# Altium schematic sheet USB.SchDoc
size A4; SheetNumber: 10; SheetTotal: 17
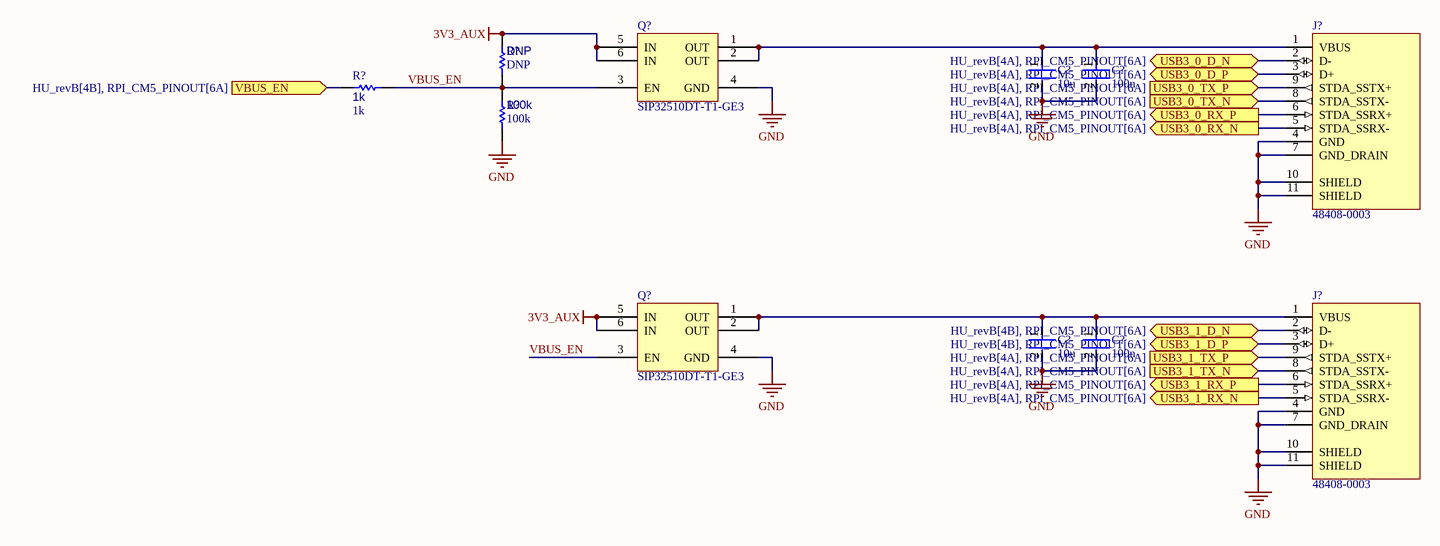
[diagram p0: USB.SchDoc]

## Parts
(Parts that share a designator on the sheet are numbered #1, #2 ... from top to bottom, then left to right.)
C?#1  10u  [FP-0402-L_1_0_0_05-W_0_5-IPC_A]
C?#2  100n  [FP-0402-L_1_0_0_05-W_0_5-IPC_A]
C?#3  10u  [FP-0402-L_1_0_0_05-W_0_5-IPC_A]
C?#4  100n  [FP-0402-L_1_0_0_05-W_0_5-IPC_A]
J?#1  48408-0003  [MOLX-48408-0003_V]
J?#2  48408-0003  [MOLX-48408-0003_V]
Q?#1  SIP32510DT-T1-GE3  [SOT95P284X110-6N]
Q?#2  SIP32510DT-T1-GE3  [SOT95P284X110-6N]
R?#1  DNP  [R0603B]
R?#2  1k  [R0603B]
R?#3  100k  [R0603B]

## Ports
USB3_0_D_N (bidir, see HU_revB[4A], RPI_CM5_PINOUT[6A]), USB3_0_D_P (bidir, see HU_revB[4A], RPI_CM5_PINOUT[6A]), USB3_0_RX_N (out, see HU_revB[4A], RPI_CM5_PINOUT[6A]), USB3_0_RX_P (out, see HU_revB[4A], RPI_CM5_PINOUT[6A]), USB3_0_TX_N (in, see HU_revB[4A], RPI_CM5_PINOUT[6A]), USB3_0_TX_P (in, see HU_revB[4A], RPI_CM5_PINOUT[6A]), USB3_1_D_N (bidir, see HU_revB[4B], RPI_CM5_PINOUT[6A]), USB3_1_D_P (bidir, see HU_revB[4B], RPI_CM5_PINOUT[6A]), USB3_1_RX_N (out, see HU_revB[4A], RPI_CM5_PINOUT[6A]), USB3_1_RX_P (out, see HU_revB[4A], RPI_CM5_PINOUT[6A]), USB3_1_TX_N (in, see HU_revB[4A], RPI_CM5_PINOUT[6A]), USB3_1_TX_P (in, see HU_revB[4A], RPI_CM5_PINOUT[6A]), VBUS_EN (in, see HU_revB[4B], RPI_CM5_PINOUT[6A])

## Nets
3V3_AUX: Q?#1.5(IN) Q?#1.6(IN) Q?#2.5(IN) Q?#2.6(IN) R?#1.2
GND: C?#1.2 C?#2.2 C?#3.2 C?#4.2 J?#1.4(GND) J?#1.7(GND_DRAIN) J?#1.10(SHIELD) J?#1.11(SHIELD) J?#2.4(GND) J?#2.7(GND_DRAIN) J?#2.10(SHIELD) J?#2.11(SHIELD) Q?#1.4(GND) Q?#2.4(GND) R?#3.1
USB3_0_D_N: J?#1.2(D-) ; port USB3_0_D_N
USB3_0_D_P: J?#1.3(D+) ; port USB3_0_D_P
USB3_0_RX_N: J?#1.5(STDA_SSRX-) ; port USB3_0_RX_N
USB3_0_RX_P: J?#1.6(STDA_SSRX+) ; port USB3_0_RX_P
USB3_0_TX_N: J?#1.8(STDA_SSTX-) ; port USB3_0_TX_N
USB3_0_TX_P: J?#1.9(STDA_SSTX+) ; port USB3_0_TX_P
USB3_1_D_N: J?#2.2(D-) ; port USB3_1_D_N
USB3_1_D_P: J?#2.3(D+) ; port USB3_1_D_P
USB3_1_RX_N: J?#2.5(STDA_SSRX-) ; port USB3_1_RX_N
USB3_1_RX_P: J?#2.6(STDA_SSRX+) ; port USB3_1_RX_P
USB3_1_TX_N: J?#2.8(STDA_SSTX-) ; port USB3_1_TX_N
USB3_1_TX_P: J?#2.9(STDA_SSTX+) ; port USB3_1_TX_P
VBUS_EN: Q?#1.3(EN) Q?#2.3(EN) R?#1.1 R?#2.1 R?#3.2
VBUS_EN: R?#2.2 ; port VBUS_EN  [a separate net that carries the same name]
NetC?#1_1: C?#1.1 C?#2.1 J?#1.1(VBUS) Q?#1.1(OUT) Q?#1.2(OUT)
NetC?#3_1: C?#3.1 C?#4.1 J?#2.1(VBUS) Q?#2.1(OUT) Q?#2.2(OUT)

## Library data of the parts
C?#1-C?#4 = CMP-001-00058-1: LARGE PADS, 0402 CAP, CHANGE COMMENT TO MATCH REAL P/N; Capacitor Type: Ceramic; Min Operating Temperature: -55°C; Mounting Technology: Surface Mount; Pins: 2; Case/Package: 0402; RoHS Compliant: Yes; Max Operating Temperature: 85°C
J?#1 J?#2 = CMP-0411-00003-1: Universal Serial Bus (USB 3.0) I/O Connector, Vertical, Type A, Through Hole, 9 Circuits, -20 to 85 degC, RoHS, Tray; No. of Positions: 9; No. of Rows: 2; Packing: Tray; Orientation: Vertical; ComponentLink3Description: Package Specification; ComponentLink2URL: http://www.molex.com/webdocs/datasheets/pdf/en-us/0484080003_IO_CONNECTORS.pdf; ComponentLink3URL: http://www.molex.com/pdm_docs/sd/484080003_sd.pdf; ComponentLink1Description: Manufacturer URL; PackageVersion: Rev. F, 12/2012; Mounting Technology: Through Hole; Temperature Min: -20 degC; ComponentLink2Description: Datasheet; PackageDescription: 9-Pin USB 3.0 I/O Receptacle, Vertical, Height 15.25 mm, Through Hole; PartNumber: 48408-0003; Temperature Max: 85 degC; RoHS: TRUE; ComponentLink1URL: http://www.molex.com/
Q?#1 Q?#2 = CMP-019-00054-1: Power Switch ICs – Power Distribution; VISHAY; SIP32510DT-T1-GE3; 1; 1; 5.5 V; SOT-23-6; Max Supply Voltage: 5.5V; Max Power Dissipation: 833mW; Min Supply Voltage: 1.2V; Case/Package: SOT-23-6; Mounting Technology: Surface Mount; Max Operating Temperature: 85°C; Min Operating Temperature: -40°C
R?#1-R?#3 = CMP-009-00002-14: Resistor
  R?#1: Value: DNP
  R?#2: Value: 1k
  R?#3: Value: 100k